# Altium schematic sheet LCD-Battery.SchDoc: Audio_Moduloop - LCD/Battery
size A; Date: 2/27/2024; DrawnBy: Team 28: Ryan Gordon, Conor Curtin, Evan Roveili, Shawn Colby; DocumentNumber: 7; Revision: V1; SheetNumber: 7; SheetTotal: 7
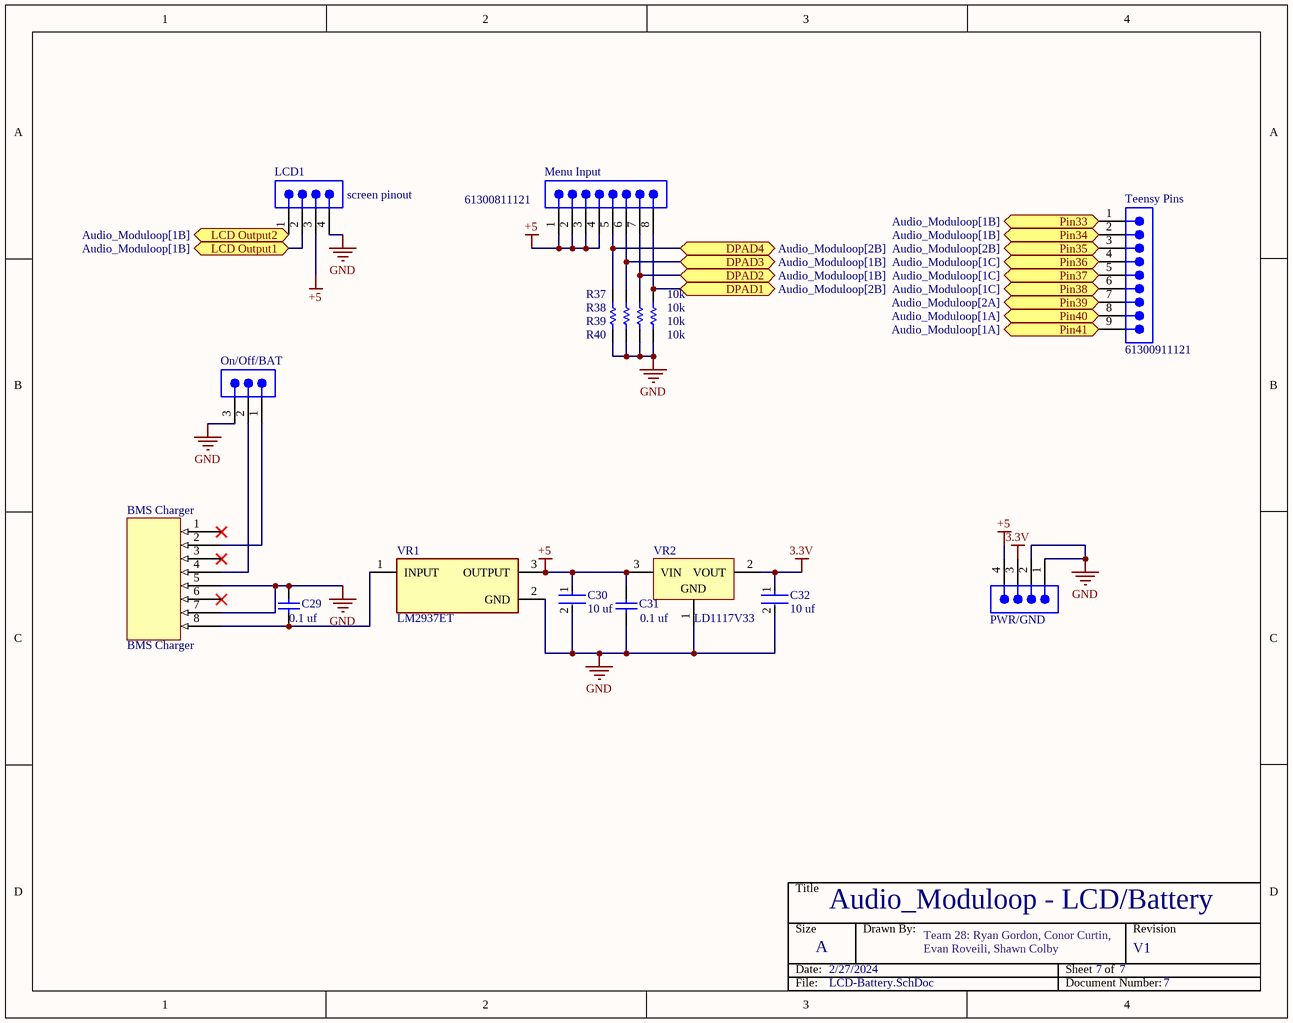
[diagram p0: LCD-Battery.SchDoc]

## Parts
BMS_Charger  BMS Charger  [MODULE_2465]
C29  0.1 uf  [AVX-SA115C104KAR]
C30  10 uf  [FP-RCE3DB-MFG]
C31  0.1 uf  [AVX-SA115C104KAR]
C32  10 uf  [FP-RCE3DB-MFG]
LCD1  screen pinout  [61900411121]
Menu_Input  61300811121  [61300811121]
On/Off/BAT  TSW-103-07-F-S  [SMTC-TSW-103-07-X-S]  (value not drawn)
PWR/GND  61300411121  [61300411121]  (value not drawn)
R37  10k  [RESC2013X60X35NL10T20]
R38  10k  [RESC2013X60X35NL10T20]
R39  10k  [RESC2013X60X35NL10T20]
R40  10k  [RESC2013X60X35NL10T20]
Teensy_Pins  61300911121  [61300911121]
VR1  LM2937ET  [FP-NDE0003B-MFG]
VR2  LD1117V33  [TO220]

## Ports
DPAD1 (bidir, see Audio_Moduloop[2B]), DPAD2 (bidir, see Audio_Moduloop[1B]), DPAD3 (bidir, see Audio_Moduloop[1B]), DPAD4 (bidir, see Audio_Moduloop[2B]), LCD Output1 (bidir, see Audio_Moduloop[1B]), LCD Output2 (bidir, see Audio_Moduloop[1B]), Pin33 (bidir, see Audio_Moduloop[1B]), Pin34 (bidir, see Audio_Moduloop[1B]), Pin35 (bidir, see Audio_Moduloop[2B]), Pin36 (bidir, see Audio_Moduloop[1C]), Pin37 (bidir, see Audio_Moduloop[1C]), Pin38 (bidir, see Audio_Moduloop[1C]), Pin39 (bidir, see Audio_Moduloop[2A]), Pin40 (bidir, see Audio_Moduloop[1A]), Pin41 (bidir, see Audio_Moduloop[1A])

## Nets
3.3V: C32.1 PWR/GND.3 VR2.2(VOUT)
+5: C30.1 C31.2 LCD1.3 Menu_Input.1 Menu_Input.2 Menu_Input.3 Menu_Input.4 PWR/GND.4 VR1.3(OUTPUT) VR2.3(VIN)
GND: BMS_Charger.5 BMS_Charger.7 C29.2 C30.2 C31.1 C32.2 LCD1.4 On/Off/BAT.3 PWR/GND.1 PWR/GND.2 R37.2 R38.2 R39.2 R40.2 VR1.2(GND) VR2.1(GND)
DPAD1: Menu_Input.8 R40.1 ; port DPAD1
DPAD2: Menu_Input.7 R39.1 ; port DPAD2
DPAD3: Menu_Input.6 R38.1 ; port DPAD3
DPAD4: Menu_Input.5 R37.1 ; port DPAD4
LCD Output1: LCD1.2 ; port LCD Output1
LCD Output2: LCD1.1 ; port LCD Output2
Pin33: Teensy_Pins.1 ; port Pin33
Pin34: Teensy_Pins.2 ; port Pin34
Pin35: Teensy_Pins.3 ; port Pin35
Pin36: Teensy_Pins.4 ; port Pin36
Pin37: Teensy_Pins.5 ; port Pin37
Pin38: Teensy_Pins.6 ; port Pin38
Pin39: Teensy_Pins.7 ; port Pin39
Pin40: Teensy_Pins.8 ; port Pin40
Pin41: Teensy_Pins.9 ; port Pin41
NetBMS_Charger_2: BMS_Charger.2 On/Off/BAT.1
NetBMS_Charger_4: BMS_Charger.4 On/Off/BAT.2
NetBMS_Charger_8: BMS_Charger.8 C29.1 VR1.1(INPUT)

Not connected (* = marked no-connect by the designer): BMS_Charger 1* 3* 6*

## Notes on the sheet
- Title
- Size
- Date:
- A
- Drawn By:
- Sheet    of
- Revision
- File:
- Document Number:

## Library data of the parts
BMS_Charger = CMP-00029-00001-2: Holder Battery; AA Battery; 3 Cells; 6 in. Wire Lead; Chassis Mount; Polypropylene
C29 C31 = CMP-2000-07029-1: Axial Leads / SpinGuard(R), Ceramic Capacitor, 0.10 uF +/- 10%, 50V, -55 to 125 degC, 2-Pin THD, RoHS, Tape and Reel; Manufacturer: AVX; Other Names: 478-3151-1; Catalog Drawings: SASeries_4.32x3.05; Capacitance: 0.1µF; Temperature Coefficient: X7R; Online Catalog: SpinGuard®SASeries; Product Training Modules: ComponentSolutionsforSmartMeterApplications; Category: Capacitors; Package Description: 2-Pin Axial Lead, Dia 3.05 mm, Body Length 4.32 mm; Standard Package: 1; Mounting Technology: ThroughHole; Ratings: -; Datasheet Version: 06/2007; Voltage - Rated: 50V; Tolerance: ±10%; Package Reference: SA115C104KAR; Packaging: -; Lead Style: -; Size / Dimension: 0.120"Diax0.170"L(3.05mmx4.32mm); Mounting Type: ThroughHole; Operating Temperature: -55°C~125°C; Datasheet URL: https://datasheet.ciiva.com/27051/1074183-27051369.pdf; Applications: GeneralPurpose; Thickness (Max): -; Lead Spacing: -; Height - Seated (Max): -; Family: CeramicCapacitors; Package / Case: Axial; Features: -; Series: SpinGuard®SA; Manufacturer URL: http://www.avx.com/
C30 C32 = CMP-06035-005830-1: Cap Ceramic 10uF 25V X7R ±10% Radial 2.5mm +125°C Automotive Ammo Pack; Lead/Base Style: Straight; Lead Diameter: 0.5mm; Case/Package: Radial; Voltage Rating (DC): 25V; Tolerance: 10%; Lead Pitch: 0.098inch; Termination: Radial; Height - Seated (Max): 0.197inch; Resistor Type: Ceramic; Min Operating Temperature: -55°C; Dielectric: X7R; Length: 0.217inch; Voltage Rating: 25V; Width: 0.157inch; Height: 5mm; Packaging: Tape and Reel; Ratings: AEC-Q200; Max Operating Temperature: 125°C; Package Quantity: 1500; Mount: Through Hole; Capacitance: 10uF
LCD1 = CMP-1502-00586-2: NexarPartId: 18818226; Connector Type: Male Pin; Insulation: Insulated; Number of Positions: 4; Gender: Male; Operating Supply Voltage: 250V; Pitch: 2.54mm; Current Rating: 3A; Insulation Resistance: 1GΩ; Contact Resistance: 20mΩ; Termination: Through Hole; Contact Material: Copper; Height: 3.3mm; Width: 10.2mm; RoHS: Compliant; REACH SVHC: Unknown; Max Operating Temperature: 105°C; Contact Plating: Tin; Lead Free: Lead Free; Contact Gender: Male; Lead Pitch: 2.54mm; Flammability Rating: UL94 V-0; Packaging: Bulk; Housing Material: Nylon; Number of Pins: 4; Number of Contacts: 4; Color: Beige; Number of Rows: 1; Orientation: Vertical; Contact Mating Length: 7.493mm; Mount: Through Hole; Min Operating Temperature: -40°C; Voltage Rating: 250V; Fastening Type: Friction; Length: 10.16mm
Menu_Input = CMP-1502-01076-2: NexarPartId: 32855533; Current Rating: 3A; Connector Type: Male Pin; Voltage Rating: 250V; Number of Contacts: 8; Pitch: 2.54mm; Contact Resistance: 20mΩ; Gender: Male; REACH SVHC: Unknown; Number of Rows: 1; Mount: Through Hole; Termination: Solder; Number of Pins: 8; Number of Positions: 8; Height: 8.54mm; Contact Mating Length: 5.9944mm; Orientation: Vertical; Operating Supply Voltage: 250V; Min Operating Temperature: -40°C; Max Operating Temperature: 105°C; Packaging: Bulk; Color: Black; Lead Pitch: 2.54mm; RoHS: Compliant; Contact Material: Copper; Contact Plating: Gold
On/Off/BAT = CMP-1024-00331-1: 0.025" SQ Post Header, Through-hole, Vertical, -55 to 125 degC, 2.54 mm Pitch, 3-Pin, Male, RoHS; Manufacturer: Samtec; Pitch: 2.54 mm; DatasheetVersion: F-214; ComponentLink1Description: Manufacturer URL; ComponentLink3URL: http://www.samtec.com/documents/webfiles/cpdf/TSW-XXX-XX-XXX-X-XX-XXX-MKT.pdf; Mounting Technology: Through-hole; PackageDescription: .025[0.64] SQ. Post Terminal Strip Assembly; Temperature Range: -55 to 125 degC; ComponentLink3Description: Package Specification; Orientation: Vertical; PartNumber: TSW-103-07-F-S; RoHS: True; PackageVersion: DM, 8/1988; ComponentLink2Description: Datasheet; ComponentLink1URL: http://www.samtec.com; ComponentLink2URL: http://www.samtec.com/documents/webfiles/pdf/TSW_TH.PDF; PackageReference: TSW-103-07-X-S
PWR/GND = CMP-1502-01064-2: NexarPartId: 32855522; Pitch: 2.54mm; Number of Contacts: 4; Contact Resistance: 20mΩ; Gender: Male; Current Rating: 3A; Connector Type: Male Pin; Voltage Rating: 250V; Lead Free: Lead Free; Contact Plating: Gold; Max Operating Temperature: 105°C; Packaging: Bulk; Height: 8.89mm; Orientation: Vertical; Contact Mating Length: 5.9944mm; Contact Material: Copper; Lead Pitch: 2.54mm; Min Operating Temperature: -40°C; Termination: Solder; Color: Black; Number of Rows: 1; REACH SVHC: Unknown; RoHS: Compliant; Mount: Through Hole; Number of Positions: 4; Number of Pins: 4; Operating Supply Voltage: 250V
R37-R40 = CMP-1659-00013-4: Chip Resistor, 10 KOhm, +/- 1%, 0.125 W, -55 to 155 degC, 0805 (2012 Metric), RoHS, Tape and Reel; Manufacturer: Yageo; Voltage Rating: 150 V; Mount: Surface Mount; ComponentLink1Description: Manufacturer URL; ComponentLink2URL: http://www.yageo.com/documents/recent/PYu-RC_Group_51_RoHS_L_04.pdf; Pins: 2; Length: 2 mm; Min Operating Temperature: -55 degC; Height: 0.5 mm; Mounting Technology: Surface Mount; RoHSCompliant: true; REACH SVHC: No SVHC; ComponentLink1URL: http://www.yageo.com/; Max Operating Temperature: 155 degC; PackageReference: 0805; DatasheetVersion: Rev. 4, 02/2016; Package Quantity: 5000; Packaging: Tape and Reel; ComponentLink2Description: Datasheet; PackageDescription: 2-Pin Surface Mounted Device, Body 2 x 1.25 mm
Teensy_Pins = CMP-1502-01080-2: NexarPartId: 32855536; Number of Contacts: 9; Current Rating: 3A; Operating Supply Voltage: 250V; Connector Type: Male Pin; Gender: Male; Contact Resistance: 20mΩ; Pitch: 2.54mm; Number of Rows: 1; Number of Pins: 9; Termination: Solder; REACH SVHC: Unknown; Orientation: Vertical; Contact Plating: Gold; Mount: Through Hole; RoHS: Compliant; Number of Positions: 9; Color: Black; Lead Pitch: 2.54mm; Packaging: Bulk; Contact Mating Length: 5.9944mm; Contact Material: Copper
VR1 = CMP-0062-02519-4: IC REG LINEAR 5V 500MA TO220-3; Manufacturer: Texas Instruments; Manufacturer Part Number: LM2937ET-5.0/NOPB; Standoff Height: 3.3mm; Max Supply Voltage: 26V; Min Supply Voltage: 6V; Max Junction Temp: +125°C; Number Of Outputs: 1; Accuracy Percentage: 5%; Dropout Voltage: 0.5V; Output Type: Fixed; Nominal Supply Current: 2-10mA; Output Voltage: 5V; Digikey Description: IC REG LINEAR 5V 500MA TO220-3; Temperature: -40°C to +125°C; Category: IC; Temperature Range High: +125°C; ComponentLink2Description: Datasheet; Package: NDE0003B; ComponentLink2URL: http://www.ti.com/lit/ds/symlink/lm2937.pdf; Ipc Land Pattern Name: TO-220; Height: 19.55mm; Device Class L3: Voltage Regulators - Linear; Automotive: No; Octopart: https://octopart.com/lm2937et-5.0%2Fnopb-texas+instruments-24813532; Device Class L1: Integrated Circuits (ICs); Output Current: 500mA; RoHS: TRUE; Temperature Range Low: -40°C; Lead Free: Yes; Device Class L2: Power Management ICs
VR2 = CMP-0244-00470-1: Fixed Low Drop Positive Voltage Regulator, 3.3V, 3-Pin TO-220; PackageVersion: ver3.0; PackageDescription: TO, Thru-Hole, Vertical, Heatsink Mounted; 3 In-Line Leads; Pitch 2.54 mm; ComponentLink1Description: Manufacturer URL; ComponentLink3URL: http://www.st.com/internet/com/TECHNICAL_RESOURCES/TECHNICAL_LITERATURE/PACKAGE_INFORMATION/CD00004649.pdf; PackageReference: TO220; ComponentLink2URL: http://www.st.com/internet/com/TECHNICAL_RESOURCES/TECHNICAL_LITERATURE/DATASHEET/CD00000544.pdf; ComponentLink3Description: Package Specification; ComponentLink2Description: Datasheet; ComponentLink1URL: http://www.st.com; DatasheetVersion: 1/11/2011